# Altium project RaspberryPi_ExpansionBoard.PrjPcb
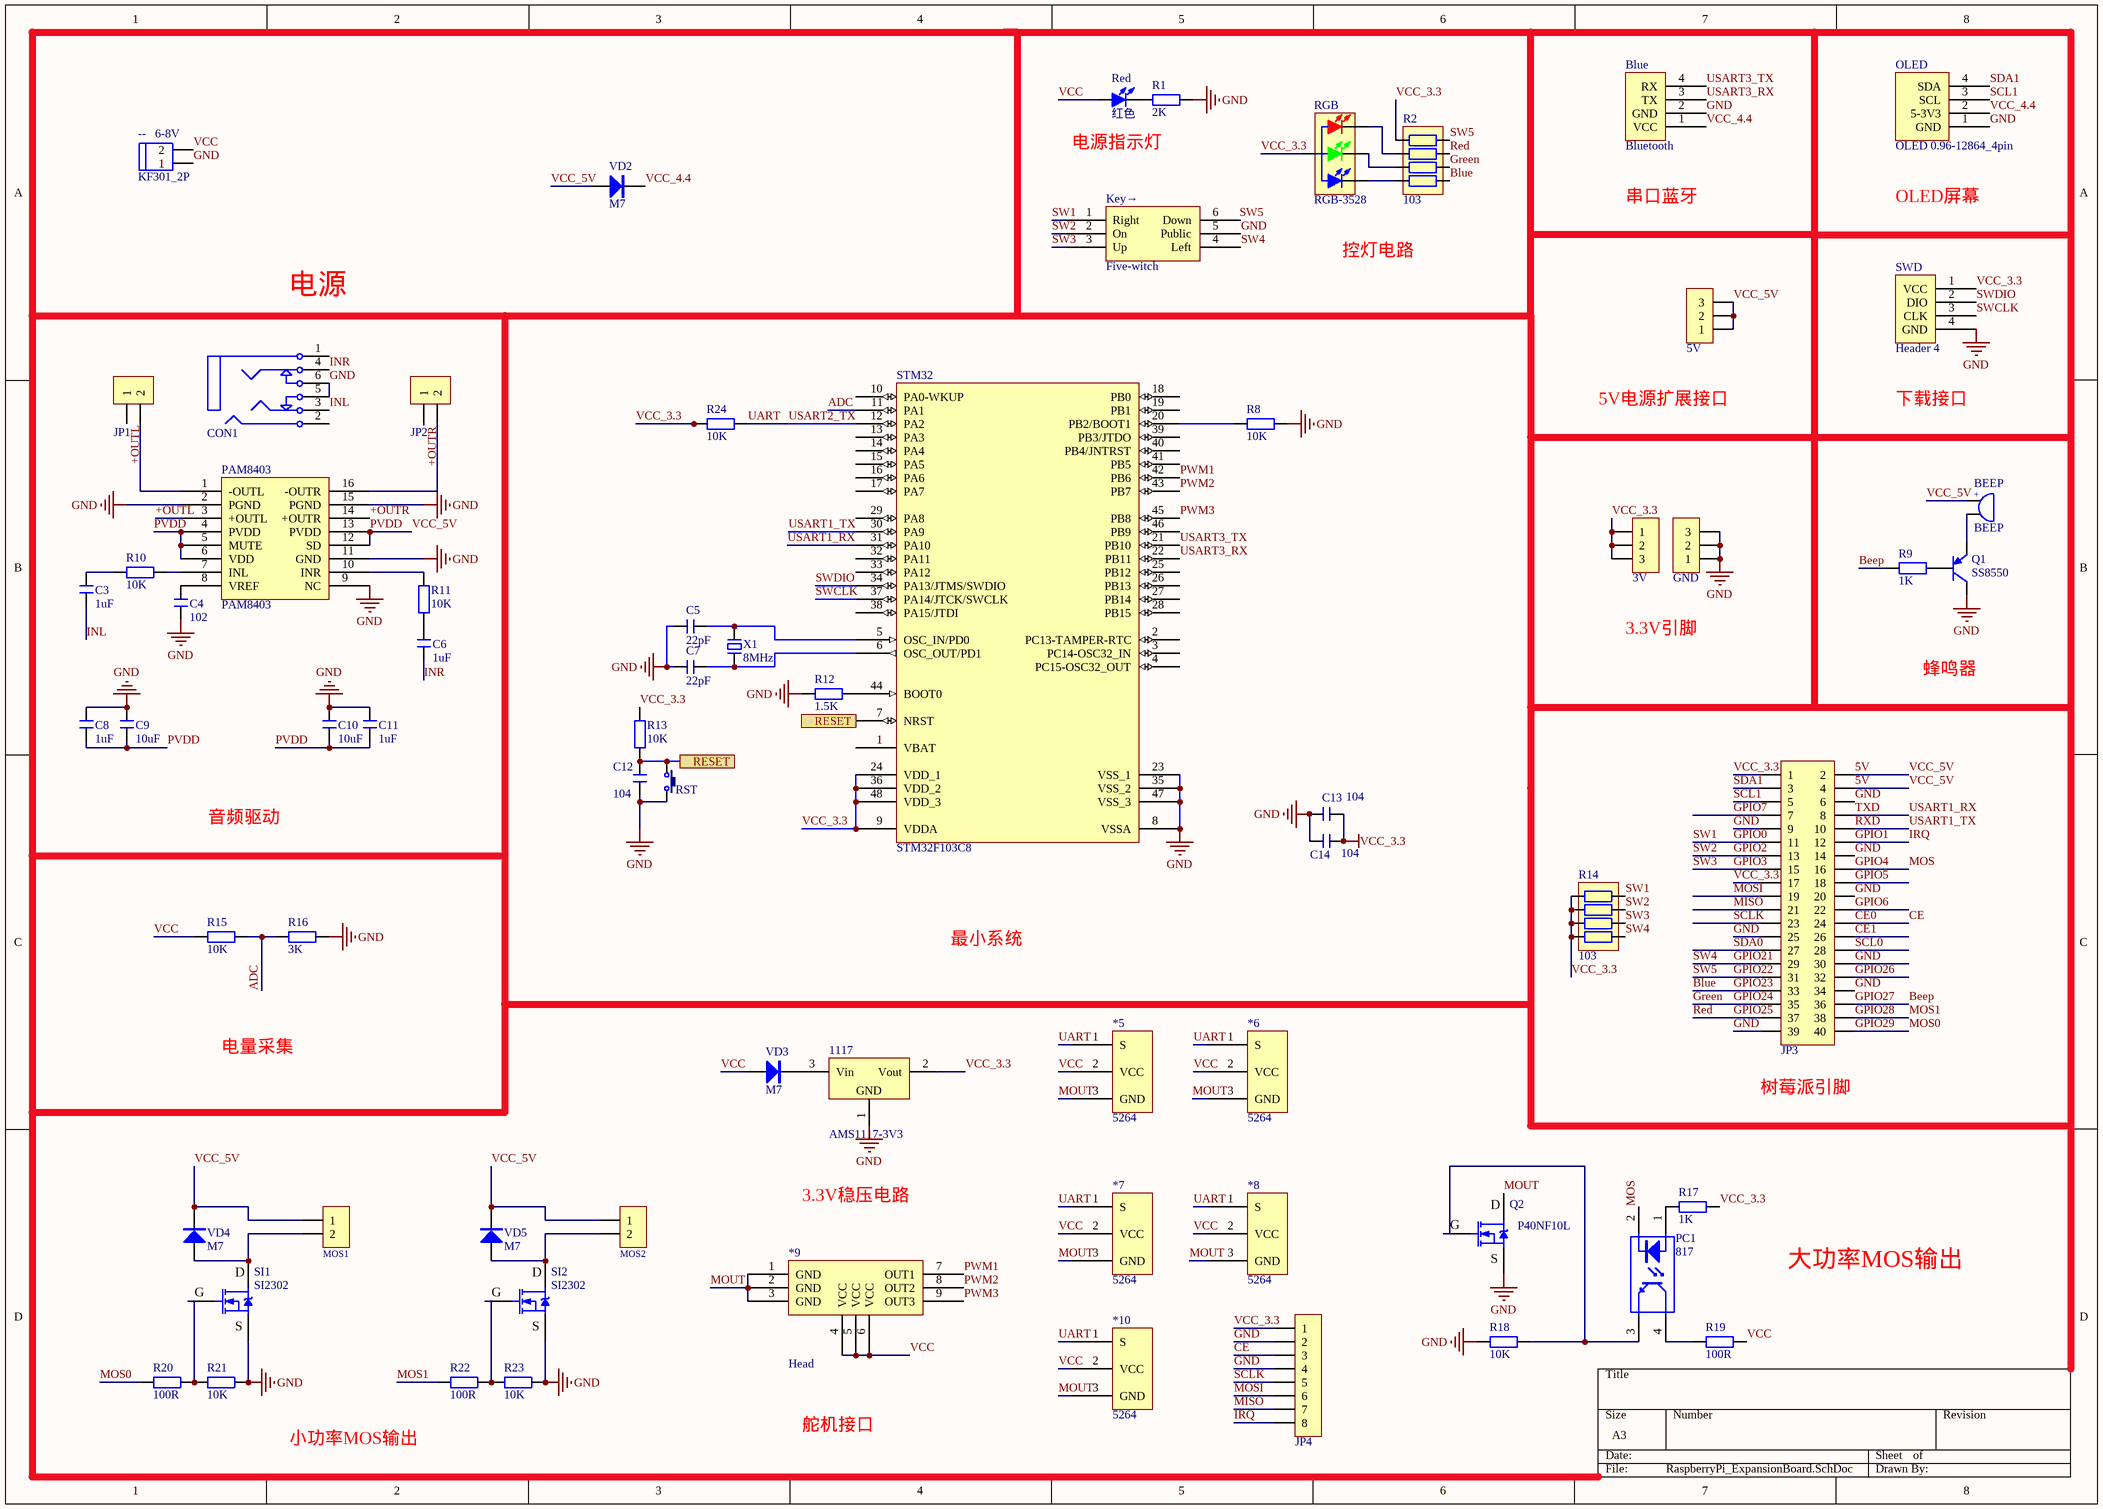
[diagram p0: RaspberryPi_ExpansionBoard.SchDoc]
1 sheet, 69 parts. Net scope: flat (ports and power ports of the same name join across sheets).
Board file: RaspberryPi_ExpansionBoard.PcbDoc

## Sheet RaspberryPi_ExpansionBoard.SchDoc
size A3

### Parts
3V  HDR-1X3  [HDR-1X3R]  (value not drawn)
5V  HDR-1X3  [HDR-1X3R]  (value not drawn)
1117  AMS1117-3V3  [SOT89_N]
*5  5264  [5264]
*6  5264  [5264]
*7  5264  [5264]
*8  5264  [5264]
*9  Head  [heard3X3]
*10  5264  [5264]
--_6-8V  KF301_2P  [KF301-2P]
BEEP  BEEP  [BEEP 5x9x5.5]
Blue  Bluetooth  [HDR-1X4_M]
C3  1uF  [C 0603]
C4  102  [C 0603]
C5  22pF  [C 0603]
C6  1uF  [C 0603]
C7  22pF  [C 0603]
C8  1uF  [C 0603]
C9  10uF  [C 0603]
C10  10uF  [C 0603]
C11  1uF  [C 0603]
C12  104  [C 0603]
C13  104  [C 0603]
C14  104  [C 0603]
CON1  PJ342  [PJ342B]  (value not drawn)
GND  HDR-1X3  [HDR-1X3]  (value not drawn)
JP1  HDR-1X2  [XH2.54-WI-2P]  (value not drawn)
JP2  HDR-1X2  [XH2.54-WI-2P]  (value not drawn)
JP3  Header 2X11  [HDR2.54-LI-2x20P]  (value not drawn)
JP4  HDR-1X8  [pad*8]  (value not drawn)
Key→  Five-witch  [Five-witch]
MOS1  HDR-1X2  [HDR-1X2]  (value not drawn)
MOS2  HDR-1X2  [HDR-1X2]  (value not drawn)
OLED  OLED 0.96-12864_4pin  [OLED 0.96-12864_4pin]
PAM8403  PAM8403  [SOP16_N]
PC1  817  [SOP4-W2.54_L]
Q1  SS8550  [TO92A]
Q2  P40NF10L  [TO252]
R1  2K  [R 0603]
R2  103  [RCA-8P4R-0603]
R8  10K  [R 0603]
R9  1K  [R 0603]
R10  10K  [R 0603]
R11  10K  [R 0603]
R12  1.5K  [R 0603]
R13  10K  [R 0603]
R14  103  [RCA-8P4R-0603]
R15  10K  [R 0603]
R16  3K  [R 0603]
R17  1K  [R 0603]
R18  10K  [R 0603]
R19  100R  [R 0603]
R20  100R  [R 0603]
R21  10K  [R 0603]
R22  100R  [R 0603]
R23  10K  [R 0603]
R24  10K  [R 0603]
Red  红色  [LED 0603R]
RGB  RGB-3528  [LED 3528-4Pin]
RST  3x6x5  [TSW SMD-3*6*2.5]  (value not drawn)
SI1  SI2302  [SOT23-3N]
SI2  SI2302  [SOT23-3N]
STM32  STM32F103C8  [LQFP48 7X7_N]
SWD  Header 4  [HDR-1X4]
VD2  M7  [SMA]
VD3  M7  [SMA]
VD4  M7  [SMA]
VD5  M7  [SMA]
X1  8MHz  [XTAL-49S DIP]

### Ports
RESET

### Nets
GND: 1117.1(GND) --_6-8V.1 Blue.2(GND) C4.1 C5.2 C7.2 C8.2 C9.2 C10.2 C11.2 C12.1 C13.1 C14.1 CON1.5 CON1.6 GND.1 GND.2 GND.3 JP3.6 JP3.9 JP3.14 JP3.20 JP3.25 JP3.30 JP3.34 JP3.39 JP4.2 JP4.4 Key→.5(Public) OLED.1(GND) PAM8403.2(PGND) PAM8403.9(NC) PAM8403.11(GND) PAM8403.15(PGND) Q1.3(C) Q2.3(S) R1.2 R8.2 R12.1 R16.2 R18.1 R21.2 R23.2 RST.2 SI1.2(S) SI2.2(S) STM32.8(VSSA) STM32.23(VSS_1) STM32.35(VSS_2) STM32.47(VSS_3) SWD.4(GND)
VCC_3.3: 3V.1 3V.2 3V.3 1117.2(Vout) C13.2 C14.2 JP3.1 JP3.17 JP4.1 R2.1 R13.2 R14.1 R14.2 R14.3 R14.4 R17.2 R24.1 RGB.4(A) STM32.9(VDDA) STM32.24(VDD_1) STM32.36(VDD_2) STM32.48(VDD_3) SWD.1(VCC)
5V: 5V.1 5V.2 5V.3 BEEP.1 C8.1 C9.1 C10.1 C11.1 JP3.2 JP3.4 MOS1.1 MOS2.1 PAM8403.4(PVDD) PAM8403.5(MUTE) PAM8403.6(VDD) PAM8403.12(SD) PAM8403.13(PVDD) VD2.1(A) VD4.2(K) VD5.2(K)  [also labelled PVDD, VCC_5V]
+OUTL: JP1.1 PAM8403.3(+OUTL)
+OUTR: JP2.1 PAM8403.14(+OUTR)
ADC: R15.2 R16.1 STM32.11(PA1)
Beep: JP3.36 R9.1  [also labelled GPIO27]
Blue: JP3.33 R2.5  [also labelled GPIO23]
CE: JP3.24 JP4.3  [also labelled CE0]
CE1: JP3.26
GPIO0: JP3.11 Key→.1(Right) R14.8  [also labelled SW1]
GPIO1: JP3.12 JP4.8  [also labelled IRQ]
GPIO2: JP3.13 Key→.2(On) R14.7  [also labelled SW2]
GPIO3: JP3.15 Key→.3(Up) R14.6  [also labelled SW3]
GPIO4: JP3.16 PC1.2(K)  [also labelled MOS]
GPIO5: JP3.18
GPIO6: JP3.22
GPIO7: JP3.7
GPIO21: JP3.29 Key→.4(Left) R14.5  [also labelled SW4]
GPIO22: JP3.31 Key→.6(Down) R2.8  [also labelled SW5]
GPIO24: JP3.35 R2.6  [also labelled Green]
GPIO25: JP3.37 R2.7  [also labelled Red]
GPIO26: JP3.32
GPIO28: JP3.38 R22.1  [also labelled MOS1]
GPIO29: JP3.40 R20.1  [also labelled MOS0]
INL: C3.1 CON1.3
INR: C6.1 CON1.4
MISO: JP3.21 JP4.7
MOSI: JP3.19 JP4.6
MOUT: *5.3(GND) *6.3(GND) *7.3(GND) *8.3(GND) *9.1(GND) *9.2(GND) *9.3(GND) *10.3(GND) Q2.2(D)
PWM1: *9.7(OUT1) STM32.42(PB6)
PWM2: *9.8(OUT2) STM32.43(PB7)
PWM3: *9.9(OUT3) STM32.45(PB8)
RXD: JP3.10 STM32.30(PA9)  [also labelled USART1_TX]
SCL0: JP3.28
SCL1: JP3.5 OLED.3(SCL)
SCLK: JP3.23 JP4.5
SDA0: JP3.27
SDA1: JP3.3 OLED.4(SDA)
SWCLK: STM32.37(PA14/JTCK/SWCLK) SWD.3(CLK)
SWDIO: STM32.34(PA13/JTMS/SWDIO) SWD.2(DIO)
TXD: JP3.8 STM32.31(PA10)  [also labelled USART1_RX]
UART: *5.1(S) *6.1(S) *7.1(S) *8.1(S) *10.1(S) R24.2 STM32.12(PA2)  [also labelled USART2_TX]
USART3_RX: Blue.3(TX) STM32.22(PB11)
USART3_TX: Blue.4(RX) STM32.21(PB10)
VCC: *5.2(VCC) *6.2(VCC) *7.2(VCC) *8.2(VCC) *9.4(VCC) *9.5(VCC) *9.6(VCC) *10.2(VCC) --_6-8V.2 R15.1 R19.2 Red.1(A) VD3.1(A)
VCC_4.4: Blue.1(VCC) OLED.2(5-3V3) VD2.2(K)
Net1117_3: 1117.3(Vin) VD3.2(K)
NetBEEP_2: BEEP.2 Q1.1(E)
NetC3_2: C3.2 R10.1
NetC4_2: C4.2 PAM8403.8(VREF)
NetC5_1: C5.1 STM32.5(OSC_IN/PD0) X1.2
NetC6_2: C6.2 R11.1
NetC7_1: C7.1 STM32.6(OSC_OUT/PD1) X1.1
NetC12_2: C12.2 R13.1 RST.1 STM32.7(NRST) ; port RESET
NetJP1_2: JP1.2 PAM8403.1(-OUTL)
NetJP2_2: JP2.2 PAM8403.16(-OUTR)
NetMOS1_2: MOS1.2 SI1.3(D) VD4.1(A)
NetMOS2_2: MOS2.2 SI2.3(D) VD5.1(A)
NetPAM8403_7: PAM8403.7(INL) R10.2
NetPAM8403_10: PAM8403.10(INR) R11.2
NetPC1_1: PC1.1(A) R17.1
NetPC1_3: PC1.3(E) Q2.1(G) R18.2
NetPC1_4: PC1.4(C) R19.1
NetQ1_2: Q1.2(B) R9.2
NetR1_1: R1.1 Red.2(K)
NetR2_2: R2.2 RGB.1(RED_K)
NetR2_3: R2.3 RGB.2(GREEN_K)
NetR2_4: R2.4 RGB.3(BULE_K)
NetR8_1: R8.1 STM32.20(PB2/BOOT1)
NetR12_2: R12.2 STM32.44(BOOT0)
NetR20_2: R20.2 R21.1 SI1.1(G)
NetR22_2: R22.2 R23.1 SI2.1(G)

Not connected (* = marked no-connect by the designer): CON1 1 2; STM32 1(VBAT) 2(PC13-TAMPER-RTC) 3(PC14-OSC32_IN) 4(PC15-OSC32_OUT) 10(PA0-WKUP) 13(PA3) 14(PA4) 15(PA5) 16(PA6) 17(PA7) 18(PB0) 19(PB1) 25(PB12) 26(PB13) 27(PB14) 28(PB15) 29(PA8) 32(PA11) 33(PA12) 38(PA15/JTDI) 39(PB3/JTDO) 40(PB4/JNTRST) 41(PB5) 46(PB9)

### Notes on the sheet
- 电源指示灯
- 串口蓝牙
- OLED屏幕
- 电源
- 控灯电路
- 5V电源扩展接口
- 下载接口
- 3.3V引脚
- 蜂鸣器
- 音频驱动
- 最小系统
- 电量采集
- (near JP3) 树莓派引脚
- 3.3V稳压电路
- 大功率MOS输出
- 小功率MOS输出
- 舵机接口
- (in symbol BEEP) +

### Library data of the parts
3V 5V GND = Header 3: 3P接插件; 版权归属: 源创客; BOM名称: 3P接插件; 学习资源: www.ooocke.com
1117 = AMS1117: 三端稳压芯片; BOM名称: 稳压芯片; 版权归属: 源创客; 学习资源: www.ooocke.com
*5-*8 *10 = 5264: 单总线舵机接口
*9 = hader_3*3
--_6-8V = HEAD2: KF301
BEEP = BEEP: 蜂鸣器; 版权归属: 源创客; BOM名称: 蜂鸣器; 学习资源: www.ooocke.com
Blue = Header4booth: 蓝牙/串口
C3-C14 = C: 无极性贴片电容; 版权归属: 源创客; BOM名称: 无极性贴片电容; 学习资源: www.ooocke.com
CON1 = PJ342: 3.5耳机插座,4Pin; BOM名称: 耳机插座; 版权归属: 源创客; 学习资源: www.ooocke.com
JP1 JP2 MOS1 MOS2 = Header 2: 2P接插件; 版权归属: 源创客; BOM名称: 2P接插件; 学习资源: www.ooocke.com
JP3 = Header 20X2: 20*2P接插件; 版权归属: 源创客; BOM名称: 20*2P接插件; 学习资源: www.ooocke.com
JP4 = Header 8: 8P接插件; 版权归属: 源创客; BOM名称: 8P接插件; 学习资源: www.ooocke.com
Key→ = Five-witch: 五向开关
OLED = OLED 0.96-12864_4pin: 12864 点阵屏
PC1 = 817: 线性光耦; 版权归属: 源创客; BOM名称: 线性光耦; 学习资源: www.ooocke.com
Q1 = 8550-DIP: 高频放大-PNP型; 版权归属: 源创客; 属性: 40V 1.5A 1W 100MHZ; BOM名称: 高频放大-PNP型; 学习资源: www.ooocke.com
Q2 = P40NF10L: N沟场效应管; 版权归属: 源创客; BOM名称: N沟场效应管; 学习资源: www.ooocke.com
R1 R8-R13 R15-R24 = R: 贴片电阻; 版权归属: 源创客; BOM名称: 贴片电阻; 学习资源: www.ooocke.com
R2 R14 = R-8P4R: 贴片网络排阻; 版权归属: 源创客; BOM名称: 贴片网络排阻; 学习资源: www.ooocke.com
Red = LED-SMD: 贴片LED; 版权归属: 源创客; BOM名称: 贴片LED; 学习资源: www.ooocke.com
RGB = LED-RGB-3528: 三基色LED; 版权归属: 源创客; BOM名称: 三基色LED; 学习资源: www.ooocke.com
RST = TSW 3x6: 3x6轻触开关; 版权归属: 源创客; BOM名称: 3x6轻触开关; 学习资源: www.ooocke.com
SI1 SI2 = SI2302: N沟道场效应管; 版权归属: 源创客; BOM名称: N沟道场效应管; 学习资源: www.ooocke.com
STM32 = STM32F103C8: Flaah:64/RAM:20/IO:36; BOM名称: 32位STM单片机; 版权归属: 源创客; 学习资源: www.ooocke.com
SWD = Header 4: SWD; LatestRevisionDate: 17-Jul-2002; LatestRevisionNote: Re-released for DXP Platform.; Publisher: Altium Limited
VD2-VD5 = M7: 整流二极管; 版权归属: 源创客; BOM名称: 整流二极管; 学习资源: www.ooocke.com
X1 = XTAL-2: 2脚晶振; 版权归属: 源创客; BOM名称: 2脚晶振; 学习资源: www.ooocke.com